# Altium schematic sheet DDR3.SchDoc (part 2 of 2)
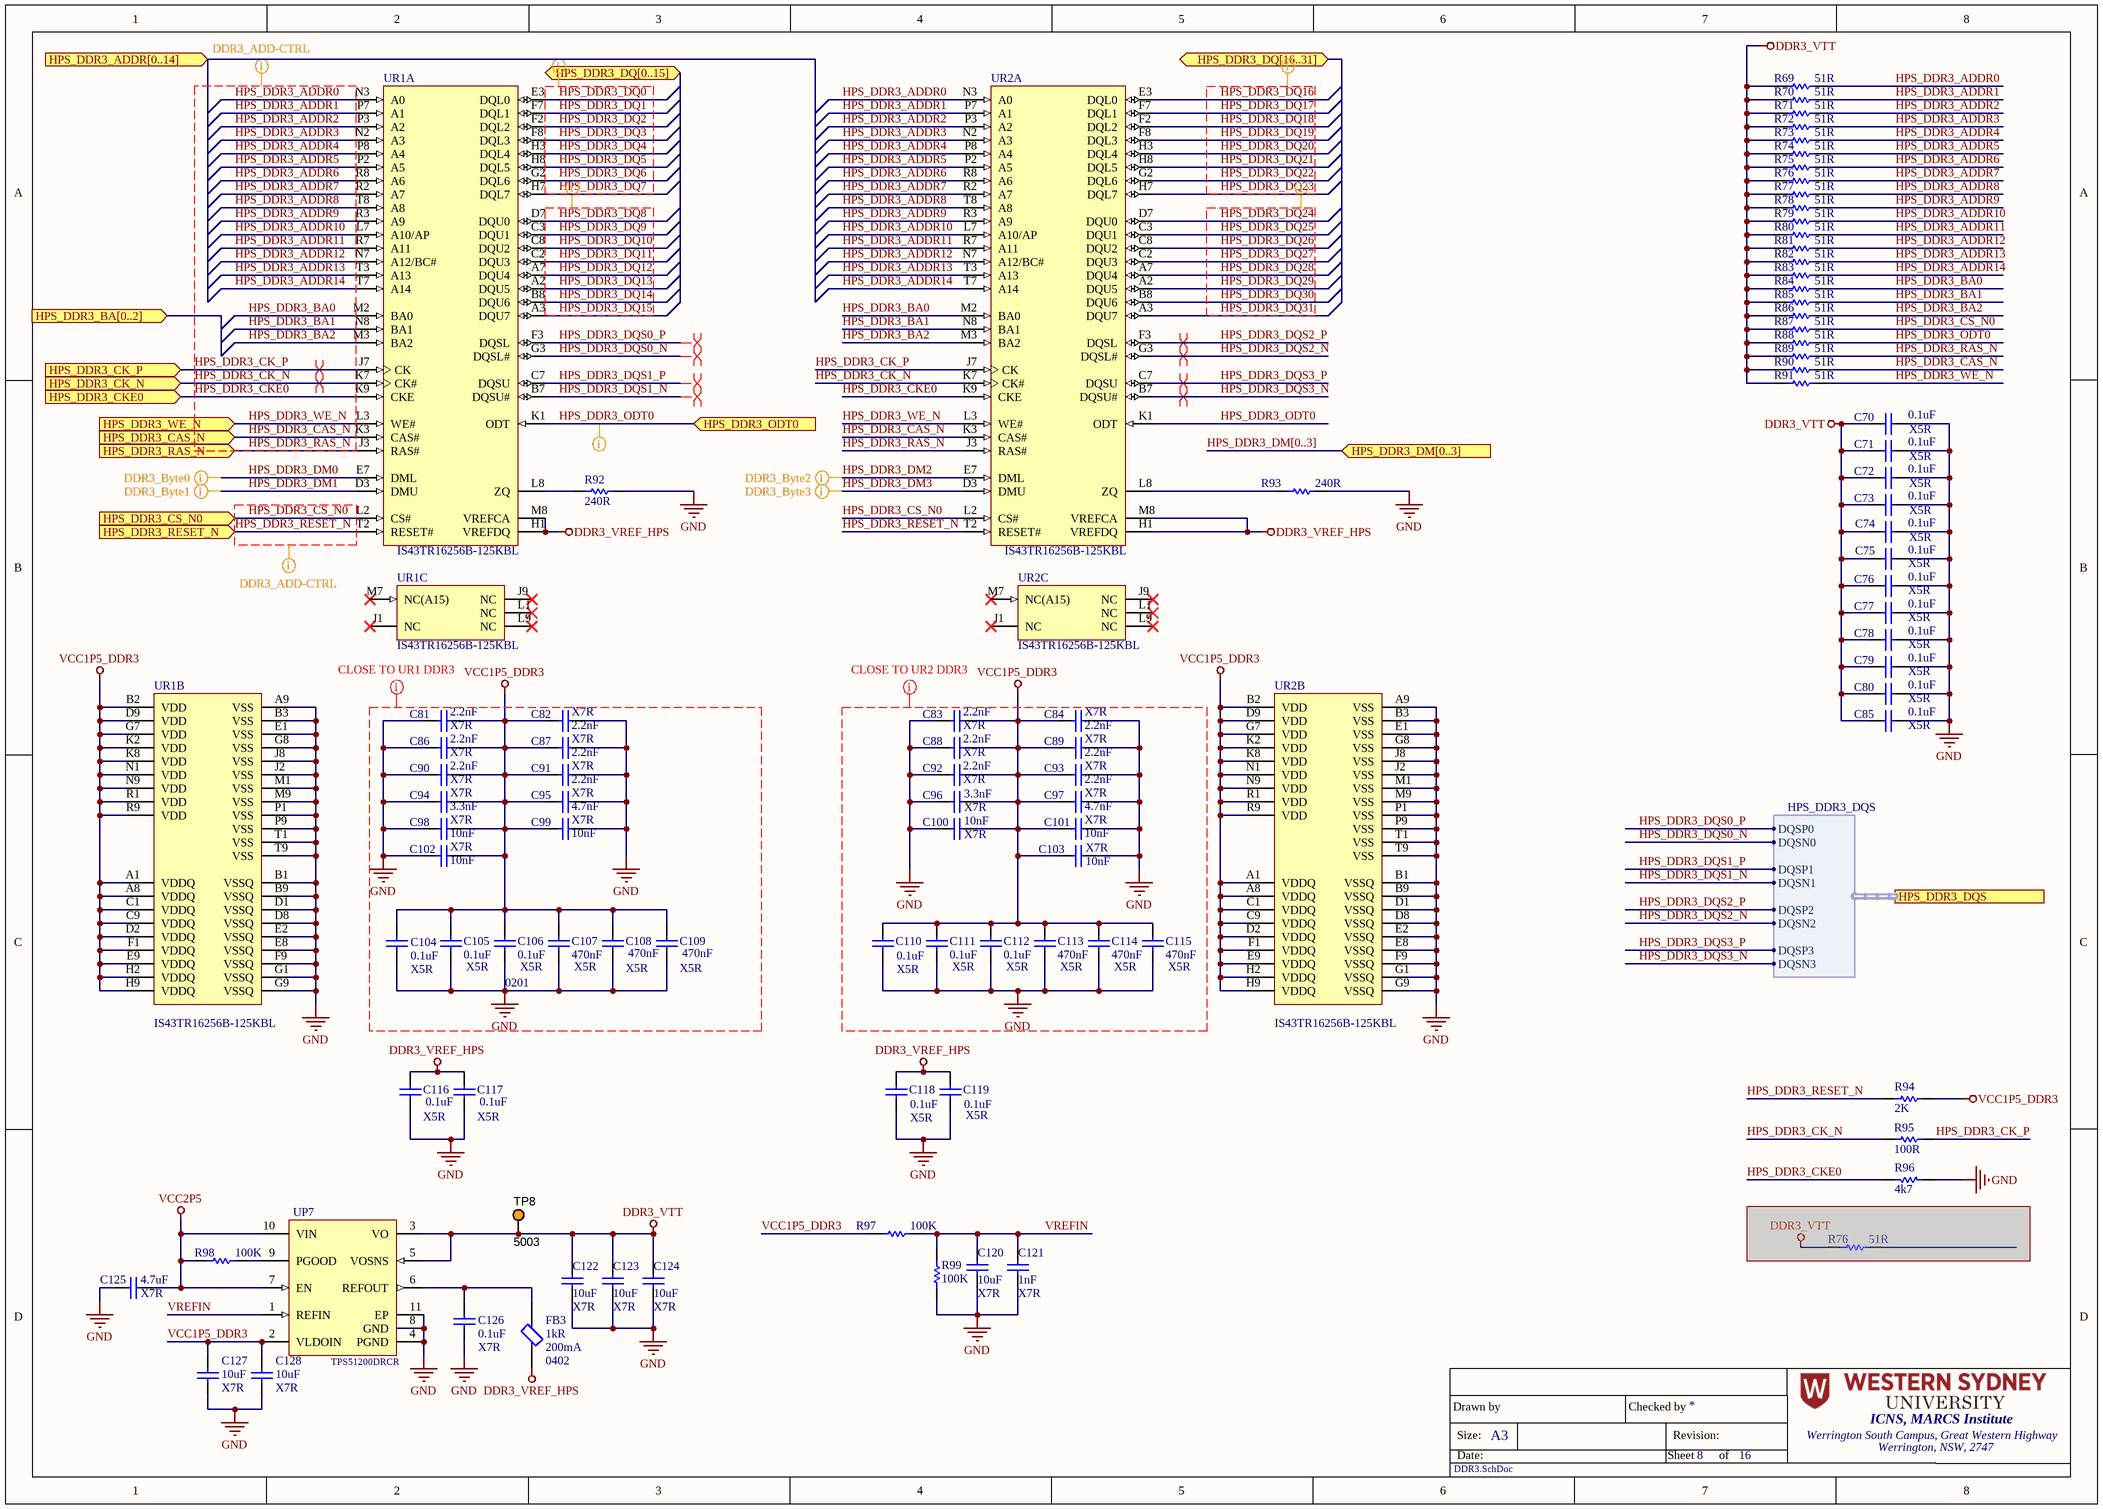
[diagram p1: DDR3.SchDoc]

## Library data of the parts
C70-C80 C85 C104-C106 C110-C112 C116-C119 = CMP-003-000014-1: Cap Ceramic 0.1uF 10V X5R 10% Pad SMD 0201 85C T/R; Manufacturer: Samsung; Capacitance: 100nF; Tolerance: 10%; ComponentLink2URL: https://datasheet.ciiva.com/26838/getdatasheetpartid-357484-26838083.pdf?src-supplier=Verical; Category: Ceramic Capacitors; Voltage Rating: 10V; Lead Free: Lead Free; Height: 0.3mm; ComponentLink2Description: https://datasheet.ciiva.com/26838/getdatasheetpartid-357484-26838083.pdf?src-supplier=Verical; RoHS: Yes; Manufacturer Part Number: CL03A104KP3NNNC; Source: ICNS_PropheseeLib.SchLib; Depth: 0.3mm; Mount: Surface Mount; Stock 1: 12175; Package Quantity: 1; Packaging: Tape and Reel; ComponentLink1Description: https://datasheet.ciiva.com/25803/cl03a104kp3nnnc-25803204.pdf?src-supplier=Digi-Key; Case Code (Metric): 0603; Width: 0.012inch; Length: 0.6mm; Radiation Hardening: No; Series: CL; Thickness: 0.013inch; Max Operating Temperature: 85°C; Design Item ID: CL03A104KP3NNNC; Voltage Rating (DC): 10V; Case/Package: 0201; Contact Plating: Tin; Min Operating Temperature: -55°C; Construction: Flat; Pricing 1: 1=0.10000, 10=0.02900, 50=0.01600, 100=0.01300, 500=0.00932, 1000=0.00732, 2500=0.00666, 5000=0.00612 (USD); ComponentLink1URL: https://datasheet.ciiva.com/25803/cl03a104kp3nnnc-25803204.pdf?src-supplier=Digi-Key
  C70-C80 C85 C104 C105 C110-C112 C116-C119: Case Code (Imperial): 0201
C81-C84 C86-C93 = CMP-003-000035-1: Cap Ceramic 2.2nF 16V X7R 10% SMD 0201 125°C Punched Paper T/R; Manufacturer: TDK; ComponentLink2Description: https://product.tdk.com/info/en/documents/chara_sheet/CGA1A2X7R1C222K030BA.pdf?src-supplier=Digi-Key; Category: Ceramic Capacitors; Tolerance: 10%; ComponentLink2URL: https://product.tdk.com/info/en/documents/chara_sheet/CGA1A2X7R1C222K030BA.pdf?src-supplier=Digi-Key; Manufacturer Part Number: CGA1A2X7R1C222K030BA; Voltage Rating: 16V; RoHS: Yes; ComponentLink1Description: http://www.mouser.com/ds/2/400/lcc_automotive_general_en-843974.pdf?src-supplier=Mouser; Case Code (Metric): 0603; Width: 0.3mm; Thickness: 0.012inch; Pricing 1: 1=0.11000, 10=0.07900, 50=0.04280, 100=0.03500, 500=0.02502, 1000=0.01966, 2500=0.01788, 5000=0.01644 (USD); Source: ICNS_PropheseeLib.SchLib; Max Operating Temperature: 125°C; Termination: SMD/SMT; ComponentLink3URL: https://product.tdk.com/info/en/catalog/datasheets/mlcc_automotive_general_en.pdf?src-supplier=Digi-Key; Case/Package: 0201; Voltage Rating (DC): 16V; Series: CGA; Case Code (Imperial): 0201; Packaging: Tape and Reel; RoHS Compliant: Yes; Design Item ID: CGA1A2X7R1C222K030BA; ComponentLink1URL: http://www.mouser.com/ds/2/400/lcc_automotive_general_en-843974.pdf?src-supplier=Mouser; Mount: Surface Mount; Min Operating Temperature: -55°C; Stock 1: 28450; Length: 0.024inch; Weight: 6E-06oz; Package Quantity: 15000; ComponentLink3Description: https://product.tdk.com/info/en/catalog/datasheets/mlcc_automotive_general_en.pdf?src-supplier=Digi-Key; Ratings: AEC-Q200; Height: 0.3mm; ComponentLink4Description: http://product.tdk.com/capacitor/mlcc/en/documents/mlcc_automotive_general_en.pdf?src-supplier=Avnet; ComponentLink4URL: http://product.tdk.com/capacitor/mlcc/en/documents/mlcc_automotive_general_en.pdf?src-supplier=Avnet
  C81 C83 C86 C88: Value: 2.2nF
  C82 C84 C87 C89-C93: Capacitance: 2.2nF
C94 C96 = CMP-003-000034-1: Cap Multilayer Ceramic 3.3nF  25 V X7R  SMT 0201 ±10% Tolerance; Manufacturer: Murata; Voltage Rating (DC): 25V; Case Code (Imperial): 0201; RoHS Compliant: Yes; Capacitance: 3.3nF; Pricing 1: 1=0.06230, 10=0.01980, 25=0.01480, 100=0.00850, 250=0.00760, 500=0.00600, 1000=0.00520, 3000=0.00430 (USD); Manufacturer Part Number: GRM033R71E332KA12D; RoHS: Yes; Source: ICNS_PropheseeLib.SchLib; ComponentLink1Description: http://www.farnell.com/datasheets/2892232.pdf?src-supplier=Farnell; Design Item ID: GRM033R71E332KA12D; Category: Ceramic Capacitors; ComponentLink1URL: http://www.farnell.com/datasheets/2892232.pdf?src-supplier=Farnell; Stock 1: 4086; Voltage Rating: 25V; Mount: Surface Mount; Width: 0.012inch; Weight: 1.2E-05oz; Thickness: 0.013inch; ComponentLink5URL: http://www.farnell.com/datasheets/2892232.pdf?src-supplier=Newark; Tolerance: 10%; Length: 0.024inch; Case/Package: 0201; ComponentLink3Description: https://search.murata.co.jp/Ceramy/image/img/A01X/G101/ENG/GRM033R71E332KA12-01.pdf?src-supplier=Digi-Key; ComponentLink2URL: http://www.mouser.com/ds/2/281/c02e-2905.pdf?src-supplier=Mouser; Height: 0.3mm; ComponentLink4Description: http://search.murata.co.jp/Ceramy/image/img/A01X/partnumbering_e_01.pdf?src-supplier=Digi-Key; ComponentLink4URL: http://search.murata.co.jp/Ceramy/image/img/A01X/partnumbering_e_01.pdf?src-supplier=Digi-Key; Packaging: Tape and Reel; ComponentLink2Description: http://www.mouser.com/ds/2/281/c02e-2905.pdf?src-supplier=Mouser; Resistor Type: Ceramic; Package Quantity: 15000; ComponentLink5Description: http://www.farnell.com/datasheets/2892232.pdf?src-supplier=Newark; Case Code (Metric): 0603; ComponentLink3URL: https://search.murata.co.jp/Ceramy/image/img/A01X/G101/ENG/GRM033R71E332KA12-01.pdf?src-supplier=Digi-Key; Min Operating Temperature: -55°C; Max Operating Temperature: 125°C; Termination: SMD/SMT
C95 C97 = CMP-003-000018-1: Cap Ceramic 4.7nF 6.3V X7R 10% Pad SMD 0201 125C Automotive T/R; Manufacturer: Yageo; Package Quantity: 1; Width: 0.012inch; Mount: Surface Mount; Capacitance: 4.7nF; Voltage Rating (DC): 6.3V; Voltage Rating: 6.3V; Length: 0.024inch; Packaging: Tape and Reel; Termination: SMD/SMT; Case/Package: 0201; Tolerance: 10%; Case Code (Imperial): 0201; Min Operating Temperature: -55°C; Lead Free: Lead Free; Thickness: 0.013inch; Case Code (Metric): 0603; Max Operating Temperature: 125°C; Design Item ID: CC0201KRX7R5BB472; ComponentLink3URL: https://datasheet.ciiva.com/176/mlccorderingcode-176531.pdf?src-supplier=Digi-Key; Stock 1: 3450; ComponentLink2URL: https://datasheet.ciiva.com/176/mlccorderingcode-176533.pdf?src-supplier=Digi-Key; Source: ICNS_PropheseeLib.SchLib; ComponentLink1URL: https://datasheet.ciiva.com/176/mlccorderingcode-176532.pdf?src-supplier=Digi-Key; RoHS: Yes; RoHS Compliant: Yes; ComponentLink3Description: https://datasheet.ciiva.com/176/mlccorderingcode-176531.pdf?src-supplier=Digi-Key; Pricing 1: 1=0.10000, 10=0.02400, 50=0.01320, 100=0.01080, 500=0.00770, 1000=0.00605, 2500=0.00550, 5000=0.00506 (USD); Manufacturer Part Number: CC0201KRX7R5BB472; ComponentLink1Description: https://datasheet.ciiva.com/176/mlccorderingcode-176532.pdf?src-supplier=Digi-Key; ComponentLink2Description: https://datasheet.ciiva.com/176/mlccorderingcode-176533.pdf?src-supplier=Digi-Key; Category: Ceramic Capacitors; Series: CC; Resistor Type: Ceramic; Halogen Free: Halogen Free; Weight: 6E-06oz
C98-C103 = CMP-003-000022-2: Cap Multilayer Ceramic 10nF 10V X7R 0201 ±10 % Tolerance SMT; Manufacturer: Murata; Tolerance: 10%; Capacitance: 10nF; Voltage Rating: 10V; ComponentLink1URL: https://datasheet.ciiva.com/129/grm033r71a103ka01-01-129814.pdf?src-supplier=Digi-Key; Source: ICNS_PropheseeLib.SchLib; Pricing 1: 1=0.10000, 10=0.02000, 50=0.01060, 100=0.00870, 500=0.00624, 1000=0.00490, 2500=0.00446, 5000=0.00410 (USD); RoHS: Yes; Manufacturer Part Number: GRM033R71A103KA01D; Design Item ID: GRM033R71A103KA01D; Category: Ceramic Capacitors; ComponentLink1Description: https://datasheet.ciiva.com/129/grm033r71a103ka01-01-129814.pdf?src-supplier=Digi-Key; Stock 1: 6245; RoHS Compliant: Yes; Material: Ceramic; ComponentLink7URL: https://datasheet.ciiva.com/5422/product-5422667.pdf?src-supplier=Mouser; ComponentLink2Description: https://datasheet.ciiva.com/129/grm033r71a103ka01-01-129815.pdf?src-supplier=Digi-Key; ComponentLink5URL: https://datasheet.ciiva.com/18184/getdatasheetpartid-158821-18184066.pdf?src-supplier=Verical; ComponentLink4URL: https://datasheet.ciiva.com/16467/product-16467346.pdf?src-supplier=Future+Electronics; ComponentLink3URL: https://datasheet.ciiva.com/11789/0900766b80ef921d-11789049.pdf?src-supplier=RSComponents; Width: 0.012inch; Thickness: 0.013inch; Packaging: Tape and Reel; Package Quantity: 1; Mount: Surface Mount; Min Operating Temperature: -55°C; Voltage: 10V; Radiation Hardening: No; Length: 0.6mm; ComponentLink3Description: https://datasheet.ciiva.com/11789/0900766b80ef921d-11789049.pdf?src-supplier=RSComponents; ComponentLink5Description: https://datasheet.ciiva.com/18184/getdatasheetpartid-158821-18184066.pdf?src-supplier=Verical; ComponentLink2URL: https://datasheet.ciiva.com/129/grm033r71a103ka01-01-129815.pdf?src-supplier=Digi-Key; Case/Package: 0201; ComponentLink6URL: https://datasheet.ciiva.com/29199/455719-da-01-en-vs-kondensator-0201-29199284.pdf?src-supplier=Conrad; Lead Free: Lead Free; Case Code (Metric): 0603; Voltage Rating (DC): 10V; ComponentLink6Description: https://datasheet.ciiva.com/29199/455719-da-01-en-vs-kondensator-0201-29199284.pdf?src-supplier=Conrad; Case Code (Imperial): 0201; ComponentLink7Description: https://datasheet.ciiva.com/5422/product-5422667.pdf?src-supplier=Mouser; ComponentLink4Description: https://datasheet.ciiva.com/16467/product-16467346.pdf?src-supplier=Future+Electronics; Height: 0.3mm; Termination: SMD/SMT; REACH SVHC: No SVHC; Max Operating Temperature: 125°C; Depth: 0.3mm
C107-C109 C113-C115 = CMP-003-000027-1: Cap Multilayer Ceramic 0.47 uF 10V X5R  0201 10% RoHS  (High dielectric type); Manufacturer: Taiyo Yuden; Capacitance: 470nF; Voltage Rating (DC): 10V; Case Code (Imperial): 0201; Design Item ID: LMK063BBJ474KPLF; Stock 1: 12200; Source: ICNS_PropheseeLib.SchLib; ComponentLink1URL: http://www.farnell.com/datasheets/2820091.pdf?src-supplier=Farnell; RoHS: Yes; RoHS Compliant: Yes; Pricing 1: 1=0.22500, 25=0.09300, 100=0.07600, 250=0.06500, 500=0.05400, 1000=0.04400 (USD); Manufacturer Part Number: LMK063BBJ474KPLF; ComponentLink1Description: http://www.farnell.com/datasheets/2820091.pdf?src-supplier=Farnell; Category: Ceramic Capacitors
C120 = CMP-003-000011-1: Cap Multilayer Ceramic 10 uF 10 V X7R ±10 % 0805 Surface Mount Capacitor; Manufacturer: Murata; Tolerance: 10%; Voltage Rating: 10V; RoHS: Yes; Mount: Surface Mount; Case/Package: 0805; Case Code (Metric): 2012; Case Code (Imperial): 0805; Min Operating Temperature: -55°C; Max Operating Temperature: 125°C; Packaging: Tape and Reel; Package Quantity: 10000; Capacitance: 10uF; Length: 0.079inch; Height: 1.25mm; Width: 1.25mm; Thickness: 0.055inch; ComponentLink1URL: http://www.mouser.com/ds/2/281/c03e-806517.pdf?src-supplier=Mouser; ComponentLink1Description: http://www.mouser.com/ds/2/281/c03e-806517.pdf?src-supplier=Mouser; ComponentLink2URL: https://search.murata.co.jp/Ceramy/image/img/A01X/G101/ENG/GCM21BR71A106KE22-01.pdf?src-supplier=Digi-Key; ComponentLink2Description: https://search.murata.co.jp/Ceramy/image/img/A01X/G101/ENG/GCM21BR71A106KE22-01.pdf?src-supplier=Digi-Key; Category: Ceramic Capacitors; Design Item ID: GCM21BR71A106KE22K; Voltage Rating (DC): 10V; Ratings: AEC-Q200; ComponentLink3URL: http://search.murata.co.jp/Ceramy/image/img/A01X/partnumbering_e_02.pdf?src-supplier=Digi-Key; Weight: 0.000335oz; ComponentLink4Description: http://search.murata.co.jp/Ceramy/image/img/A01X/G101/ENG/GCM21BR71A106KE22-01.pdf?src-supplier=Digi-Key; RoHS Compliant: Yes; Manufacturer Part Number: GCM21BR71A106KE22K; Source: ICNS_PropheseeLib.SchLib; Pricing: 1=0.45000, 10=0.31600, 50=0.23880, 100=0.20790, 500=0.15400, 1000=0.13090, 2500=0.12320, 5000=0.11550 (USD); Stock: 4655; ComponentLink4URL: http://search.murata.co.jp/Ceramy/image/img/A01X/G101/ENG/GCM21BR71A106KE22-01.pdf?src-supplier=Digi-Key; Termination: SMD/SMT; ComponentLink3Description: http://search.murata.co.jp/Ceramy/image/img/A01X/partnumbering_e_02.pdf?src-supplier=Digi-Key
C121 = CMP-003-000012-1: Cap Ceramic 1nF 50V X7R 10% Pad SMD 0402 125 Automotive T/R; Manufacturer: Murata; RoHS: Yes; Mount: Surface Mount; Case/Package: 0402; Case Code (Metric): 1005; Case Code (Imperial): 0402; Min Operating Temperature: -55°C; Max Operating Temperature: 125°C; Tolerance: 10%; Packaging: Tape and Reel; Package Quantity: 1; Capacitance: 1nF; Voltage Rating: 50V; Length: 1mm; Height: 0.5mm; Width: 0.02inch; Thickness: 0.022inch; Depth: 0.5mm; Radiation Hardening: No; ComponentLink1URL: https://datasheet.ciiva.com/130/product-130720.pdf?src-supplier=Digi-Key; ComponentLink1Description: https://datasheet.ciiva.com/130/product-130720.pdf?src-supplier=Digi-Key; ComponentLink2URL: https://datasheet.ciiva.com/3778/3103gcm155r71h102ka3723-3778878.pdf?src-supplier=Arrow+Electronics; ComponentLink2Description: https://datasheet.ciiva.com/3778/3103gcm155r71h102ka3723-3778878.pdf?src-supplier=Arrow+Electronics; Voltage: 50V; ComponentLink4Description: https://datasheet.ciiva.com/11786/0900766b80ef92d0-11786143.pdf?src-supplier=RSComponents; ComponentLink3URL: https://datasheet.ciiva.com/18183/getdatasheetpartid-140970-18183520.pdf?src-supplier=Verical; Lead Free: Lead Free; Category: Ceramic Capacitors; ComponentLink5URL: https://datasheet.ciiva.com/16213/product-16213384.pdf?src-supplier=Future+Electronics; REACH SVHC: No SVHC; Construction: Flat; ComponentLink5Description: https://datasheet.ciiva.com/16213/product-16213384.pdf?src-supplier=Future+Electronics; Ratings: AEC-Q200; Voltage Rating (DC): 50V; ComponentLink4URL: https://datasheet.ciiva.com/11786/0900766b80ef92d0-11786143.pdf?src-supplier=RSComponents; Source: ICNS_PropheseeLib.SchLib; Design Item ID: GCM155R71H102KA37D; Series: GCM; RoHS Compliant: Yes; Pricing: 10000=0.00552, 20000=0.00526 (USD); Manufacturer Part Number: GCM155R71H102KA37D; Stock: 16085757; Termination: SMD/SMT; ComponentLink3Description: https://datasheet.ciiva.com/18183/getdatasheetpartid-140970-18183520.pdf?src-supplier=Verical
C122-C124 C127 C128 = CMP-003-000011-1: Cap Multilayer Ceramic 4.7uF 10V X7R 10% 0805 Emboss T/R; Manufacturer: Murata; RoHS: Yes; Mount: Surface Mount; Case/Package: 0805; Case Code (Metric): 2012; Case Code (Imperial): 0805; Min Operating Temperature: -55°C; Max Operating Temperature: 125°C; Tolerance: 10%; Packaging: Tape and Reel; Package Quantity: 10000; Capacitance: 10uF; Voltage Rating: 10V; Length: 0.079inch; Height: 1.25mm; Width: 1.25mm; Thickness: 0.055inch; ComponentLink1URL: http://www.mouser.com/ds/2/281/c03e-806517.pdf?src-supplier=Mouser; ComponentLink1Description: http://www.mouser.com/ds/2/281/c03e-806517.pdf?src-supplier=Mouser; ComponentLink2URL: https://search.murata.co.jp/Ceramy/image/img/A01X/G101/ENG/GCM21BR71A106KE22-01.pdf?src-supplier=Digi-Key; ComponentLink2Description: https://search.murata.co.jp/Ceramy/image/img/A01X/G101/ENG/GCM21BR71A106KE22-01.pdf?src-supplier=Digi-Key; Category: Ceramic Capacitors; Design Item ID: GCM21BR71A106KE22K; Voltage Rating (DC): 10V; Ratings: AEC-Q200; ComponentLink3URL: http://search.murata.co.jp/Ceramy/image/img/A01X/partnumbering_e_02.pdf?src-supplier=Digi-Key; Weight: 0.000335oz; ComponentLink4Description: http://search.murata.co.jp/Ceramy/image/img/A01X/G101/ENG/GCM21BR71A106KE22-01.pdf?src-supplier=Digi-Key; RoHS Compliant: Yes; Manufacturer Part Number: GCM21BR71A106KE22K; Source: ICNS_PropheseeLib.SchLib; Pricing: 1=0.45000, 10=0.31600, 50=0.23880, 100=0.20790, 500=0.15400, 1000=0.13090, 2500=0.12320, 5000=0.11550 (USD); Stock: 4655; ComponentLink4URL: http://search.murata.co.jp/Ceramy/image/img/A01X/G101/ENG/GCM21BR71A106KE22-01.pdf?src-supplier=Digi-Key; Termination: SMD/SMT; ComponentLink3Description: http://search.murata.co.jp/Ceramy/image/img/A01X/partnumbering_e_02.pdf?src-supplier=Digi-Key
C125 = CMP-003-000004-1: Cap Multilayer Ceramic 4.7uF 10V X7R 10% 0805 Emboss T/R; Manufacturer: Taiyo Yuden; RoHS: Yes; Case Code (Imperial): 0805; Capacitance: 4.7uF; Voltage Rating: 10V; ComponentLink1URL: https://4donline.ihs.com/images/VipMasterIC/IC/TAIY/TAIY-S-A0007931891/TAIY-S-A0007932234-1.pdf?hkey=6D3A4C79FDBF58556ACFDE234799DDF0&src-supplier=Farnell; ComponentLink1Description: https://4donline.ihs.com/images/VipMasterIC/IC/TAIY/TAIY-S-A0007931891/TAIY-S-A0007932234-1.pdf?hkey=6D3A4C79FDBF58556ACFDE234799DDF0&src-supplier=Farnell; ComponentLink2URL: https://4donline.ihs.com/images/VipMasterIC/IC/TAIY/TAIY-S-A0007931891/TAIY-S-A0007932234-1.pdf?hkey=6D3A4C79FDBF58556ACFDE234799DDF0&src-supplier=Newark; ComponentLink2Description: https://4donline.ihs.com/images/VipMasterIC/IC/TAIY/TAIY-S-A0007931891/TAIY-S-A0007932234-1.pdf?hkey=6D3A4C79FDBF58556ACFDE234799DDF0&src-supplier=Newark; RoHS Compliant: Yes; Stock: 11345; Design Item ID: LMF212B7475KGHT; Manufacturer Part Number: LMF212B7475KGHT; Pricing: 1=0.35000, 10=0.24200, 50=0.16140, 100=0.13720, 500=0.09688, 1000=0.08477 (USD); Category: Ceramic Capacitors; Source: ICNS_PropheseeLib.SchLib
C126 = CMP-003-000005-1: Cap Ceramic 0.1uF 10V X7R 20% SMD 0402 125°C Paper T/R; Manufacturer 1: KEMET; Capacitance: 100nF; Dissipation Factor: 5%; Manufacturer Part Number 1: C0402C104M8RACTU; Stock 1: 32450; Pricing 1: 1=0.00400, 25=0.00400, 100=0.00400, 250=0.00400, 500=0.00400, 1000=0.00400 (USD); RoHS: Yes; Mount: Surface Mount; Case/Package: 0402; Case Code (Metric): 1005; Case Code (Imperial): 0402; Min Operating Temperature: -55°C; Max Operating Temperature: 125°C; Tolerance: 20%; Packaging: Tape and Reel; Package Quantity: 10000; Voltage Rating: 10V; Length: 1mm; Height: 0.5mm; Width: 0.02inch; Thickness: 0.022inch; Depth: 0.5mm; Radiation Hardening: No; ComponentLink1URL: https://datasheet.ciiva.com/26948/getdatasheetpartid-791262-26948427.pdf?src-supplier=Verical; ComponentLink1Description: https://datasheet.ciiva.com/26948/getdatasheetpartid-791262-26948427.pdf?src-supplier=Verical; Source: ICNS_PropheseeLib.SchLib; Description 1: Cap Ceramic 0.1uF 10V X7R 20% SMD 0402 125°C Paper T/R; Category: Ceramic Capacitors; RoHS Compliant: Yes; Lead Pitch: 0.3mm; Design Item ID: C0402C104M8RACTU; Termination: SMD/SMT; Dielectric Material: Ceramic; Voltage Rating (DC): 10V; Series: C
FB3 = CMP-005-000016-1: Ferrite Bead 1KΩ @ 100MHz ±25% DCR=0.65Ω 300mA SMT 0402; Manufacturer: Murata; DC Resistance (DCR): 650mR; Shielding: Unshielded; Number of Circuits: 1; Material: Ferrite,Steel; DC Resistance-Max: 1R; Current Rating: 300mA; Max Operating Temperature: 125°C; Min Operating Temperature: -55°C; Number of Pins: 2; Pricing 1: 10000=0.01770, 20000=0.01580, 30000=0.01540, 50000=0.01410 (USD); RoHS: Yes; Stock 1: 1670000; Test Frequency: 100MHz; Tolerance: 25%; Source: ICNS_PropheseeLib.SchLib; Design Item ID: BLM15AG102SN1D; Category: Ferrite Beads and Chips; ComponentLink7Description: https://datasheet.ciiva.com/14122/blm-series-eng-tds-14122895.pdf?src-supplier=Distrelec; ComponentLink2Description: https://datasheet.ciiva.com/18093/getdatasheetpartid-153001-18093091.pdf?src-supplier=Verical; Core Material: Ferrite; ComponentLink8Description: https://datasheet.ciiva.com/1011/l0110s0100blm15ag-sn-1011988.pdf?src-supplier=Digi-Key; ComponentLink5Description: https://datasheet.ciiva.com/1466/5144-1466738.pdf?src-supplier=Element14; Series: BLM15AG_SN; ComponentLink10Description: https://datasheet.ciiva.com/1011/l0110s0100blm15ag-sn-1011989.pdf?src-supplier=Digi-Key; Frequency: 100MHz; Termination: SMD/SMT; ComponentLink9URL: https://datasheet.ciiva.com/1011/l0110s0100blm15ag-sn-1011987.pdf?src-supplier=Digi-Key; ComponentLink4Description: https://datasheet.ciiva.com/41449/001172159-da-01-en-drossel-0402-1000r-1-0x0-5mm-10000st-41449447.pdf?src-supplier=Conrad; Radiation Hardening: No; RoHS Compliant: Yes; ComponentLink1URL: https://datasheet.ciiva.com/11799/0900766b811b5866-11799186.pdf?src-supplier=RSComponents; Lead Free: Lead Free; Width: 0.5mm; Depth: 0.55mm; Manufacturer Part Number: BLM15AG102SN1D; ComponentLink7URL: https://datasheet.ciiva.com/14122/blm-series-eng-tds-14122895.pdf?src-supplier=Distrelec; ComponentLink1Description: https://datasheet.ciiva.com/11799/0900766b811b5866-11799186.pdf?src-supplier=RSComponents; Case/Package: 0402; ComponentLink2URL: https://datasheet.ciiva.com/18093/getdatasheetpartid-153001-18093091.pdf?src-supplier=Verical; ComponentLink9Description: https://datasheet.ciiva.com/1011/l0110s0100blm15ag-sn-1011987.pdf?src-supplier=Digi-Key; ComponentLink11URL: https://datasheet.ciiva.com/3081/l0110s0100blm15ag-sn-3081597.pdf?src-supplier=Avnet; ComponentLink12Description: https://datasheet.ciiva.com/3081/l0110s0100blm15ag-sn-3081596.pdf?src-supplier=Avnet; ComponentLink3Description: https://datasheet.ciiva.com/41425/001171673-da-01-en-chip-drossel0402-1000r-300ma-1-0x0-5mm-41425718.pdf?src-supplier=Conrad; Case Code (Metric): 1005; Number of Lines: 1; Height: 0.5mm; Max Current Rating: 300mA; ComponentLink5URL: https://datasheet.ciiva.com/1466/5144-1466738.pdf?src-supplier=Element14; ComponentLink6URL: https://datasheet.ciiva.com/1466/5144-1466739.pdf?src-supplier=Element14; ComponentLink4URL: https://datasheet.ciiva.com/41449/001172159-da-01-en-drossel-0402-1000r-1-0x0-5mm-10000st-41449447.pdf?src-supplier=Conrad; ComponentLink11Description: https://datasheet.ciiva.com/3081/l0110s0100blm15ag-sn-3081597.pdf?src-supplier=Avnet; ComponentLink12URL: https://datasheet.ciiva.com/3081/l0110s0100blm15ag-sn-3081596.pdf?src-supplier=Avnet; Packaging: Tape and Reel; ComponentLink3URL: https://datasheet.ciiva.com/41425/001171673-da-01-en-chip-drossel0402-1000r-300ma-1-0x0-5mm-41425718.pdf?src-supplier=Conrad; ComponentLink10URL: https://datasheet.ciiva.com/1011/l0110s0100blm15ag-sn-1011989.pdf?src-supplier=Digi-Key; ComponentLink8URL: https://datasheet.ciiva.com/1011/l0110s0100blm15ag-sn-1011988.pdf?src-supplier=Digi-Key; Length: 1mm; ComponentLink6Description: https://datasheet.ciiva.com/1466/5144-1466739.pdf?src-supplier=Element14; REACH SVHC: No SVHC; Military Standard: Not; DC Current: 200mA; Package Quantity: 1
R69-R75 R76#1 R77-R91 = CMP-006-000049-2: Res Thick Film 0201 51 Ohm 1% 1/20W ±100ppm/°C Molded SMD SMD Paper T/R; Manufacturer: Vishay Dale; Value: 51R; Power Rating: 50mW; Voltage Rating: 30V; ComponentLink1URL: https://datasheet.ciiva.com/9001/crcw0201e3-9001308.pdf?src-supplier=Avnet; Stock 1: 10000; Source: ICNS_PropheseeLib.SchLib; Manufacturer Part Number: CRCW020151R0FKED; Case Code (Imperial): 0201; RoHS: Yes; Weight: 6E-06oz; Resistor Type: Thick Film; Contact Plating: Tin; Package Quantity: 10000; Series: CRCW; Construction: Rectangular; ComponentLink2Description: https://datasheet.ciiva.com/2580/crcw0201e3-2580389.pdf?src-supplier=Digi-Key; Packaging: Tape and Reel; Radiation Hardening: No; ComponentLink3URL: https://datasheet.ciiva.com/17176/crcw0201e3-17176971.pdf?src-supplier=Avnet+Europe; Min Operating Temperature: -55°C; Military Standard: Not; Pricing 1: 1=0.28000, 10=0.24000, 100=0.09400, 1000=0.03933, 2500=0.03605, 5000=0.03278 (USD); RoHS Compliant: Yes; ComponentLink2URL: https://datasheet.ciiva.com/2580/crcw0201e3-2580389.pdf?src-supplier=Digi-Key; Length: 0.6mm; Max Power Dissipation: 50mW; Width: 0.012inch; Temperature Coefficient: 100ppm/°C; Case Code (Metric): 0603; ComponentLink1Description: https://datasheet.ciiva.com/9001/crcw0201e3-9001308.pdf?src-supplier=Avnet; Height: 0.011inch; Category: Chip SMD Resistors; Max Operating Temperature: 155°C; Number of Terminations: 2; Case/Package: 0201; Design Item ID: CRCW020151R0FKED; ComponentLink3Description: https://datasheet.ciiva.com/17176/crcw0201e3-17176971.pdf?src-supplier=Avnet+Europe; Depth: 0.3mm; Tolerance: 1%; Lead Free: Lead Free
R76#2 = CMP-006-000049-2: Res Thick Film 0201 51 Ohm 1% 1/20W ±100ppm/°C Molded SMD SMD Paper T/R; Manufacturer: Vishay Dale; Max Power Dissipation: 50mW; Voltage Rating: 30V; Value: 51R; Package Quantity: 10000; Case/Package: 0201; Lead Free: Lead Free; Pricing 1: 1=0.28000, 10=0.24000, 100=0.09400, 1000=0.03933, 2500=0.03605, 5000=0.03278 (USD); Weight: 6E-06oz; ComponentLink2URL: https://datasheet.ciiva.com/2580/crcw0201e3-2580389.pdf?src-supplier=Digi-Key; ComponentLink1URL: https://datasheet.ciiva.com/9001/crcw0201e3-9001308.pdf?src-supplier=Avnet; Depth: 0.3mm; Resistor Type: Thick Film; Category: Chip SMD Resistors; Series: CRCW; Stock 1: 10000; RoHS: Yes; Case Code (Metric): 0603; Number of Terminations: 2; Construction: Rectangular; ComponentLink2Description: https://datasheet.ciiva.com/2580/crcw0201e3-2580389.pdf?src-supplier=Digi-Key; ComponentLink3Description: https://datasheet.ciiva.com/17176/crcw0201e3-17176971.pdf?src-supplier=Avnet+Europe; Min Operating Temperature: -55°C; Military Standard: Not; Temperature Coefficient: 100ppm/°C; Design Item ID: CRCW020151R0FKED; RoHS Compliant: Yes; Radiation Hardening: No; Source: ICNS_PropheseeLib.SchLib; ComponentLink1Description: https://datasheet.ciiva.com/9001/crcw0201e3-9001308.pdf?src-supplier=Avnet; Manufacturer Part Number: CRCW020151R0FKED; Length: 0.6mm; Power Rating: 50mW; ComponentLink3URL: https://datasheet.ciiva.com/17176/crcw0201e3-17176971.pdf?src-supplier=Avnet+Europe; Contact Plating: Tin; Packaging: Tape and Reel; Width: 0.012inch; Case Code (Imperial): 0201; Height: 0.011inch; Tolerance: 1%; Max Operating Temperature: 155°C
R92 R93 = CMP-006-000023-1: Res Thick Film 0201 240 Ohm 1% 0.05W(1/20W) ±200ppm/C Pad SMD Automotive T/R; Manufacturer: Yageo; Max Power Dissipation: 50mW; Temperature Coefficient: 200ppm/°C; RoHS: Yes; Case/Package: 0201; Case Code (Metric): 0603; Case Code (Imperial): 0201; Min Operating Temperature: -55°C; Max Operating Temperature: 155°C; Tolerance: 1%; Number of Terminations: 2; Width: 0.012inch; ComponentLink1URL: http://www.yageo.com/NewPortal/yageodocoutput?fileName=/pdf/R-Chip/PYu-AC_51_RoHS_L_6.pdf&src-supplier=Digi-Key; ComponentLink1Description: http://www.yageo.com/NewPortal/yageodocoutput?fileName=/pdf/R-Chip/PYu-AC_51_RoHS_L_6.pdf&src-supplier=Digi-Key; Stock 1: 26116; Pricing 1: 1=0.10000, 10=0.06600, 100=0.02670, 1000=0.01201, 2500=0.01042, 5000=0.00861 (USD); Features: Moisture Resistant,Automotive AEC-Q200; Resistance: 240R; Packaging: Tape and Reel; Length: 0.024inch; Height: 0.01inch; Source: ICNS_PropheseeLib.SchLib; Design Item ID: AC0201FR-07240RL; RoHS Compliant: Yes; Category: Chip SMD Resistors; Manufacturer Part Number: AC0201FR-07240RL; Resistor Type: Thick Film
R94 = CMP-006-000024-1: Res Thick Film 0201 2K Ohm 1% 1/20W ±100ppm/°C Molded SMD SMD Paper T/R; Manufacturer: Vishay Dale; Max Power Dissipation: 50mW; Resistance: 2kR; Voltage Rating: 30V; RoHS: Yes; Case/Package: 0201; Case Code (Metric): 0603; Case Code (Imperial): 0201; Min Operating Temperature: -55°C; Max Operating Temperature: 155°C; Tolerance: 1%; Number of Terminations: 2; Temperature Coefficient: 100ppm/°C; Width: 0.3mm; ComponentLink1URL: https://datasheet.ciiva.com/3255/crcw0201e3-3255934.pdf?src-supplier=Avnet; ComponentLink1Description: https://datasheet.ciiva.com/3255/crcw0201e3-3255934.pdf?src-supplier=Avnet; Stock 1: 17990; Pricing 1: 1=0.28000, 10=0.24000, 100=0.09400, 1000=0.03933, 2500=0.03605, 5000=0.03278 (USD); Contact Plating: Tin; Military Standard: Not; Termination: SMD/SMT; Power Rating: 50mW; Packaging: Tape and Reel; Length: 0.6mm; Height: 0.23mm; Depth: 0.3mm; Lead Free: Lead Free; Source: ICNS_PropheseeLib.SchLib; Series: CRCW; Category: Chip SMD Resistors; Radiation Hardening: No; Resistor Type: Thick Film; Design Item ID: CRCW02012K00FKED; Construction: Rectangular; RoHS Compliant: Yes; Manufacturer Part Number: CRCW02012K00FKED; Voltage Rating (DC): 30V; Weight: 6E-06oz
R95 = CMP-006-000037-1: Res Thick Film 0201 100 Ohm 1% 1/20W ±100ppm/°C Molded SMD SMD Paper T/R; Manufacturer: Vishay Dale; Max Power Dissipation: 50mW; Voltage Rating: 30V; RoHS: Yes; Mount: Surface Mount; Case/Package: 0201; Case Code (Metric): 0603; Case Code (Imperial): 0201; Min Operating Temperature: -55°C; Max Operating Temperature: 155°C; Tolerance: 1%; Number of Terminations: 2; Temperature Coefficient: 100ppm/°C; Width: 0.3mm; ComponentLink1URL: https://datasheet.ciiva.com/16207/dcrcwe3-16207386.pdf?src-supplier=Future+Electronics; ComponentLink1Description: https://datasheet.ciiva.com/16207/dcrcwe3-16207386.pdf?src-supplier=Future+Electronics; ComponentLink2URL: https://datasheet.ciiva.com/17172/crcw0201e3-17172232.pdf?src-supplier=Avnet+Europe; ComponentLink2Description: https://datasheet.ciiva.com/17172/crcw0201e3-17172232.pdf?src-supplier=Avnet+Europe; Stock 1: 3196; Pricing 1: 1=0.28000, 10=0.24000, 100=0.09400, 1000=0.03933, 2500=0.03605, 5000=0.03278 (USD); Contact Plating: Tin; Military Standard: Not; Termination: SMD/SMT; Package Quantity: 10000; Resistance: 100R; Power Rating: 50mW; Packaging: Tape and Reel; Length: 0.6mm; Height: 0.23mm; Depth: 0.3mm; Category: Chip SMD Resistors; Weight: 6E-06oz; Resistance Tolerance: 1%; Series: CRCW; Construction: Rectangular; REACH SVHC: Unknown; Number of Pins: 2; RoHS Compliant: Yes; Radiation Hardening: No; Design Item ID: CRCW0201100RFKED; Source: ICNS_PropheseeLib.SchLib; Resistor Type: Thick Film; Manufacturer Part Number: CRCW0201100RFKED; Size Code: 0201
R96 = CMP-006-000022-1: Res Thick Film 0201 4.7K Ohm 1% 1/20W ±200ppm/°C Molded SMD Paper T/R; Manufacturer: Yageo; Max Power Dissipation: 50mW; Resistance: 4.7kR; RoHS: Yes; Case/Package: 0201; Case Code (Metric): 0603; Case Code (Imperial): 0201; Min Operating Temperature: -55°C; Max Operating Temperature: 155°C; Tolerance: 1%; Number of Terminations: 2; Temperature Coefficient: 200ppm/°C; Width: 0.012inch; ComponentLink1URL: http://www.yageo.com/NewPortal/yageodocoutput?fileName=/pdf/R-Chip/PYu-AC_51_RoHS_L_6.pdf&src-supplier=Digi-Key; ComponentLink1Description: http://www.yageo.com/NewPortal/yageodocoutput?fileName=/pdf/R-Chip/PYu-AC_51_RoHS_L_6.pdf&src-supplier=Digi-Key; Stock 1: 267560; Pricing 1: 1=0.10000, 10=0.06600, 100=0.02670, 1000=0.01201, 2500=0.01042, 5000=0.00861 (USD); Features: Moisture Resistant,Automotive AEC-Q200; Packaging: Tape and Reel; Length: 0.024inch; Height: 0.01inch; Lead Free: Lead Free; Source: ICNS_PropheseeLib.SchLib; Manufacturer Part Number: AC0201FR-074K7L; Design Item ID: AC0201FR-074K7L; Category: Chip SMD Resistors; Resistor Type: Thick Film
R97 R99 = CMP-006-000009-1: Res Thick Film 0402 100K Ohm 1% 0.2W(1/5W) ±100ppm/C Pad SMD Automotive T/R; Manufacturer 1: Vishay Dale; Max Power Dissipation: 125mW; Temperature Coefficient: 100ppm/°C; Resistance: 100kR; Voltage Rating (DC): 50V; RoHS: Yes; Mount: Surface Mount; Case/Package: 0402; Case Code (Metric): 1005; Case Code (Imperial): 0402; Min Operating Temperature: -55°C; Max Operating Temperature: 155°C; Tolerance: 1%; Number of Terminations: 2; Width: 0.02inch; ComponentLink1URL: https://datasheet.ciiva.com/2498/crcwhpe3-2498716.pdf?src-supplier=Digi-Key; ComponentLink1Description: https://datasheet.ciiva.com/2498/crcwhpe3-2498716.pdf?src-supplier=Digi-Key; ComponentLink2URL: https://datasheet.ciiva.com/2498/crcwhpe3-2498717.pdf?src-supplier=Digi-Key; ComponentLink2Description: https://datasheet.ciiva.com/2498/crcwhpe3-2498717.pdf?src-supplier=Digi-Key; ComponentLink3URL: https://datasheet.ciiva.com/2498/crcwhpe3-2498718.pdf?src-supplier=Digi-Key; ComponentLink3Description: https://datasheet.ciiva.com/2498/crcwhpe3-2498718.pdf?src-supplier=Digi-Key; Manufacturer Part Number 1: CRCW0402100KFKEDHP; Stock 1: 96553; Pricing 1: 10000=0.01543 (USD); Contact Plating: Tin; Features: Automotive AEC-Q200; Termination: SMD/SMT; Package Quantity: 10; Power Rating: 125mW; Packaging: Tape and Reel; Length: 1mm; Height: 0.3mm; Depth: 0.5mm; Lead Free: Lead Free; ComponentLink4URL: https://datasheet.ciiva.com/8982/crcwhpe3-8982553.pdf?src-supplier=Avnet; ComponentLink4Description: https://datasheet.ciiva.com/8982/crcwhpe3-8982553.pdf?src-supplier=Avnet; ComponentLink5URL: https://datasheet.ciiva.com/48525/crcwhpe3-48525582.pdf?src-supplier=Avnet; Series: CRCW-HP; REACH SVHC: Unknown; ComponentLink7Description: https://datasheet.ciiva.com/46441/1703058-46441599.pdf?src-supplier=Element14; RoHS Compliant: Yes; Weight: 2.3E-05oz; Design Item ID: CRCW0402100KFKEDHP; Resistor Type: Thick Film; ComponentLink6Description: https://datasheet.ciiva.com/5548/crcwhpe3-46056-5548557.pdf?src-supplier=Mouser; ComponentLink5Description: https://datasheet.ciiva.com/48525/crcwhpe3-48525582.pdf?src-supplier=Avnet; ComponentLink6URL: https://datasheet.ciiva.com/5548/crcwhpe3-46056-5548557.pdf?src-supplier=Mouser; Radiation Hardening: No; Resistance Tolerance: 1%; Description 1: Res Thick Film 0402 100K Ohm 1% 0.2W(1/5W) ±100ppm/C Pad SMD Automotive T/R; ComponentLink7URL: https://datasheet.ciiva.com/46441/1703058-46441599.pdf?src-supplier=Element14; Source: ICNS_PropheseeLib.SchLib; Category: Chip SMD Resistors; Voltage Rating: 50V; Technology: THICK FILM
R98 = CMP-006-000009-1: Res Thick Film 0402 100K Ohm 1% 0.2W(1/5W) ±100ppm/C Pad SMD Automotive T/R; Manufacturer 1: Vishay Dale; Resistance: 100kR; Temperature Coefficient: 100ppm/°C; Max Power Dissipation: 125mW; Voltage Rating (DC): 50V; ComponentLink1URL: https://datasheet.ciiva.com/2498/crcwhpe3-2498716.pdf?src-supplier=Digi-Key; ComponentLink5URL: https://datasheet.ciiva.com/48525/crcwhpe3-48525582.pdf?src-supplier=Avnet; Tolerance: 1%; Height: 0.3mm; Features: Automotive AEC-Q200; Mount: Surface Mount; RoHS: Yes; Series: CRCW-HP; Lead Free: Lead Free; REACH SVHC: Unknown; Case Code (Metric): 1005; ComponentLink7Description: https://datasheet.ciiva.com/46441/1703058-46441599.pdf?src-supplier=Element14; RoHS Compliant: Yes; Weight: 2.3E-05oz; Packaging: Tape and Reel; Min Operating Temperature: -55°C; Width: 0.02inch; Package Quantity: 10; ComponentLink3URL: https://datasheet.ciiva.com/2498/crcwhpe3-2498718.pdf?src-supplier=Digi-Key; Design Item ID: CRCW0402100KFKEDHP; ComponentLink4Description: https://datasheet.ciiva.com/8982/crcwhpe3-8982553.pdf?src-supplier=Avnet; Resistor Type: Thick Film; Contact Plating: Tin; ComponentLink6Description: https://datasheet.ciiva.com/5548/crcwhpe3-46056-5548557.pdf?src-supplier=Mouser; ComponentLink3Description: https://datasheet.ciiva.com/2498/crcwhpe3-2498718.pdf?src-supplier=Digi-Key; Termination: SMD/SMT; Pricing 1: 10000=0.01543 (USD); ComponentLink5Description: https://datasheet.ciiva.com/48525/crcwhpe3-48525582.pdf?src-supplier=Avnet; Length: 1mm; Max Operating Temperature: 155°C; Case Code (Imperial): 0402; ComponentLink2URL: https://datasheet.ciiva.com/2498/crcwhpe3-2498717.pdf?src-supplier=Digi-Key; ComponentLink6URL: https://datasheet.ciiva.com/5548/crcwhpe3-46056-5548557.pdf?src-supplier=Mouser; ComponentLink2Description: https://datasheet.ciiva.com/2498/crcwhpe3-2498717.pdf?src-supplier=Digi-Key; Radiation Hardening: No; Resistance Tolerance: 1%; Description 1: Res Thick Film 0402 100K Ohm 1% 0.2W(1/5W) ±100ppm/C Pad SMD Automotive T/R; ComponentLink7URL: https://datasheet.ciiva.com/46441/1703058-46441599.pdf?src-supplier=Element14; Power Rating: 125mW; Source: ICNS_PropheseeLib.SchLib; Category: Chip SMD Resistors; Voltage Rating: 50V; Number of Terminations: 2; Stock 1: 96553; Manufacturer Part Number 1: CRCW0402100KFKEDHP; ComponentLink1Description: https://datasheet.ciiva.com/2498/crcwhpe3-2498716.pdf?src-supplier=Digi-Key; ComponentLink4URL: https://datasheet.ciiva.com/8982/crcwhpe3-8982553.pdf?src-supplier=Avnet; Technology: THICK FILM; Case/Package: 0402; Depth: 0.5mm
TP8 = CMP-002-00037-2: Test Point, Orange, Height 4.6 mm, Tail Length 3 mm, 1-Pin THD, RoHS; Manufacturer: Keystone; Contact Material: Bronze; Contact Plating: Tin; Colour: Orange; Packaging: Bulk; Package Description: 1-Pin Through Hole Device, Dia 2.54 mm; Pins: 1; Package Reference: 5003; Datasheet Version: Jun-15; Case/Package: 5003; Mounting Technology: TH; Connector Type: TestPoint; Diameter: 2.54mm; Datasheet URL: http://keyelco.com/userAssets/file/M65p56.pdf; Manufacturer URL: http://www.keyelco.com/; Package Quantity: 10; RoHS Compliant: True
UP7 = CMP-008-000000-1: TPS51200 3A Sink/source DDR Term; Manufacturer 1: Texas Instruments; Max Input Voltage: 3.5V; Quiescent Current: 500uA; Accuracy: 5%; Number of Outputs: 1; Reference Voltage: 1.8V; Nominal Output Voltage: 1.25V; Power Dissipation: 1.92W; Min Input Voltage: 2.3V; Output Type: Adjustable,Fixed; Power Rating: 790mW; Polarity: Positive,Negative; ComponentLink1URL: https://datasheet.ciiva.com/41462/001014815-da-01-en-ic-reg-sink-sou-tps51200drcr-vson-10-tid-41462660.pdf?src-supplier=Conrad; ComponentLink3URL: https://datasheet.ciiva.com/2077/tps51200-2077370.pdf?src-supplier=Digi-Key; ComponentLink4URL: https://datasheet.ciiva.com/2077/tps51200-2077371.pdf?src-supplier=Digi-Key; ComponentLink3Description: https://datasheet.ciiva.com/2077/tps51200-2077370.pdf?src-supplier=Digi-Key; ComponentLink2URL: https://datasheet.ciiva.com/26910/tps51200drcr-26910761.pdf?src-supplier=IIIC; ComponentLink2Description: https://datasheet.ciiva.com/26910/tps51200drcr-26910761.pdf?src-supplier=IIIC; ComponentLink4Description: https://datasheet.ciiva.com/2077/tps51200-2077371.pdf?src-supplier=Digi-Key; ComponentLink1Description: https://datasheet.ciiva.com/41462/001014815-da-01-en-ic-reg-sink-sou-tps51200drcr-vson-10-tid-41462660.pdf?src-supplier=Conrad; Number of Pins: 10; REACH SVHC: No SVHC; RoHS: Yes; ComponentLink8Description: https://datasheet.ciiva.com/7993/1862503-7993311.pdf?src-supplier=Element14; Description 1: TPS51200 3A Sink/source Ddr Term; Length: 3.1mm; RoHS Compliant: Yes; ComponentLink5Description: https://datasheet.ciiva.com/2077/tps51200-2077372.pdf?src-supplier=Digi-Key; Height: 0.95mm; Series: -; ComponentLink6URL: https://datasheet.ciiva.com/3224/tps51200-3224253.pdf?src-supplier=Avnet; Design Item ID: TPS51200DRCR; Output Voltage: 3.5V; Category: Voltage Regulators - Linear; Packaging: Tape and Reel; ComponentLink7URL: https://datasheet.ciiva.com/3224/tps51200-3224254.pdf?src-supplier=Avnet; ComponentLink7Description: https://datasheet.ciiva.com/3224/tps51200-3224254.pdf?src-supplier=Avnet; ComponentLink9Description: https://datasheet.ciiva.com/22746/1862503-22746727.pdf?src-supplier=Element14; Package Quantity: 1; Lead Free: Lead Free; Max Output Current: 3A; ComponentLink5URL: https://datasheet.ciiva.com/2077/tps51200-2077372.pdf?src-supplier=Digi-Key; Min Operating Temperature: -40°C; ComponentLink6Description: https://datasheet.ciiva.com/3224/tps51200-3224253.pdf?src-supplier=Avnet; Radiation Hardening: No; Output Current: 3A; Max Operating Temperature: 85°C; Max Power Dissipation: 1.92W; Width: 3.1mm; Pricing 1: 5=0.95100, 50=0.75900, 100=0.58400, 250=0.55100, 500=0.51400 (USD); Manufacturer Part Number 1: TPS51200DRCR; Source: ICNS_PropheseeLib.SchLib; Case/Package: SON; Stock 1: 4; ComponentLink9URL: https://datasheet.ciiva.com/22746/1862503-22746727.pdf?src-supplier=Element14; ComponentLink8URL: https://datasheet.ciiva.com/7993/1862503-7993311.pdf?src-supplier=Element14
UR1 UR2 = CMP-008-000011-1: 4G, 1.5V, DDR3, 256MX16, 1600MT/S @ 11-11-11, 96 Ball BGA (9MM X13MM) Rohs; Manufacturer: ISSI; RoHS: Yes; Manufacturer Part Number: IS43TR16256B-125KBL; RoHS Compliant: No; Design Item ID: IS43TR16256B-125KBL; Pricing 1: 1=10.41000, 10=9.64400, 25=9.42480, 40=9.37425, 190=8.25232, 380=7.84279, 570=7.76425, 950=7.65000 (USD); Source: ICNS_PropheseeLib.SchLib; Category: Memory